# EAGLE schematic source_eagle (EAGLE 9.6.2)
COMPANY: ADAFRUIT INDUSTRIES; DRAWN: KTOWN; REV: B

## Sheet 1 of 2
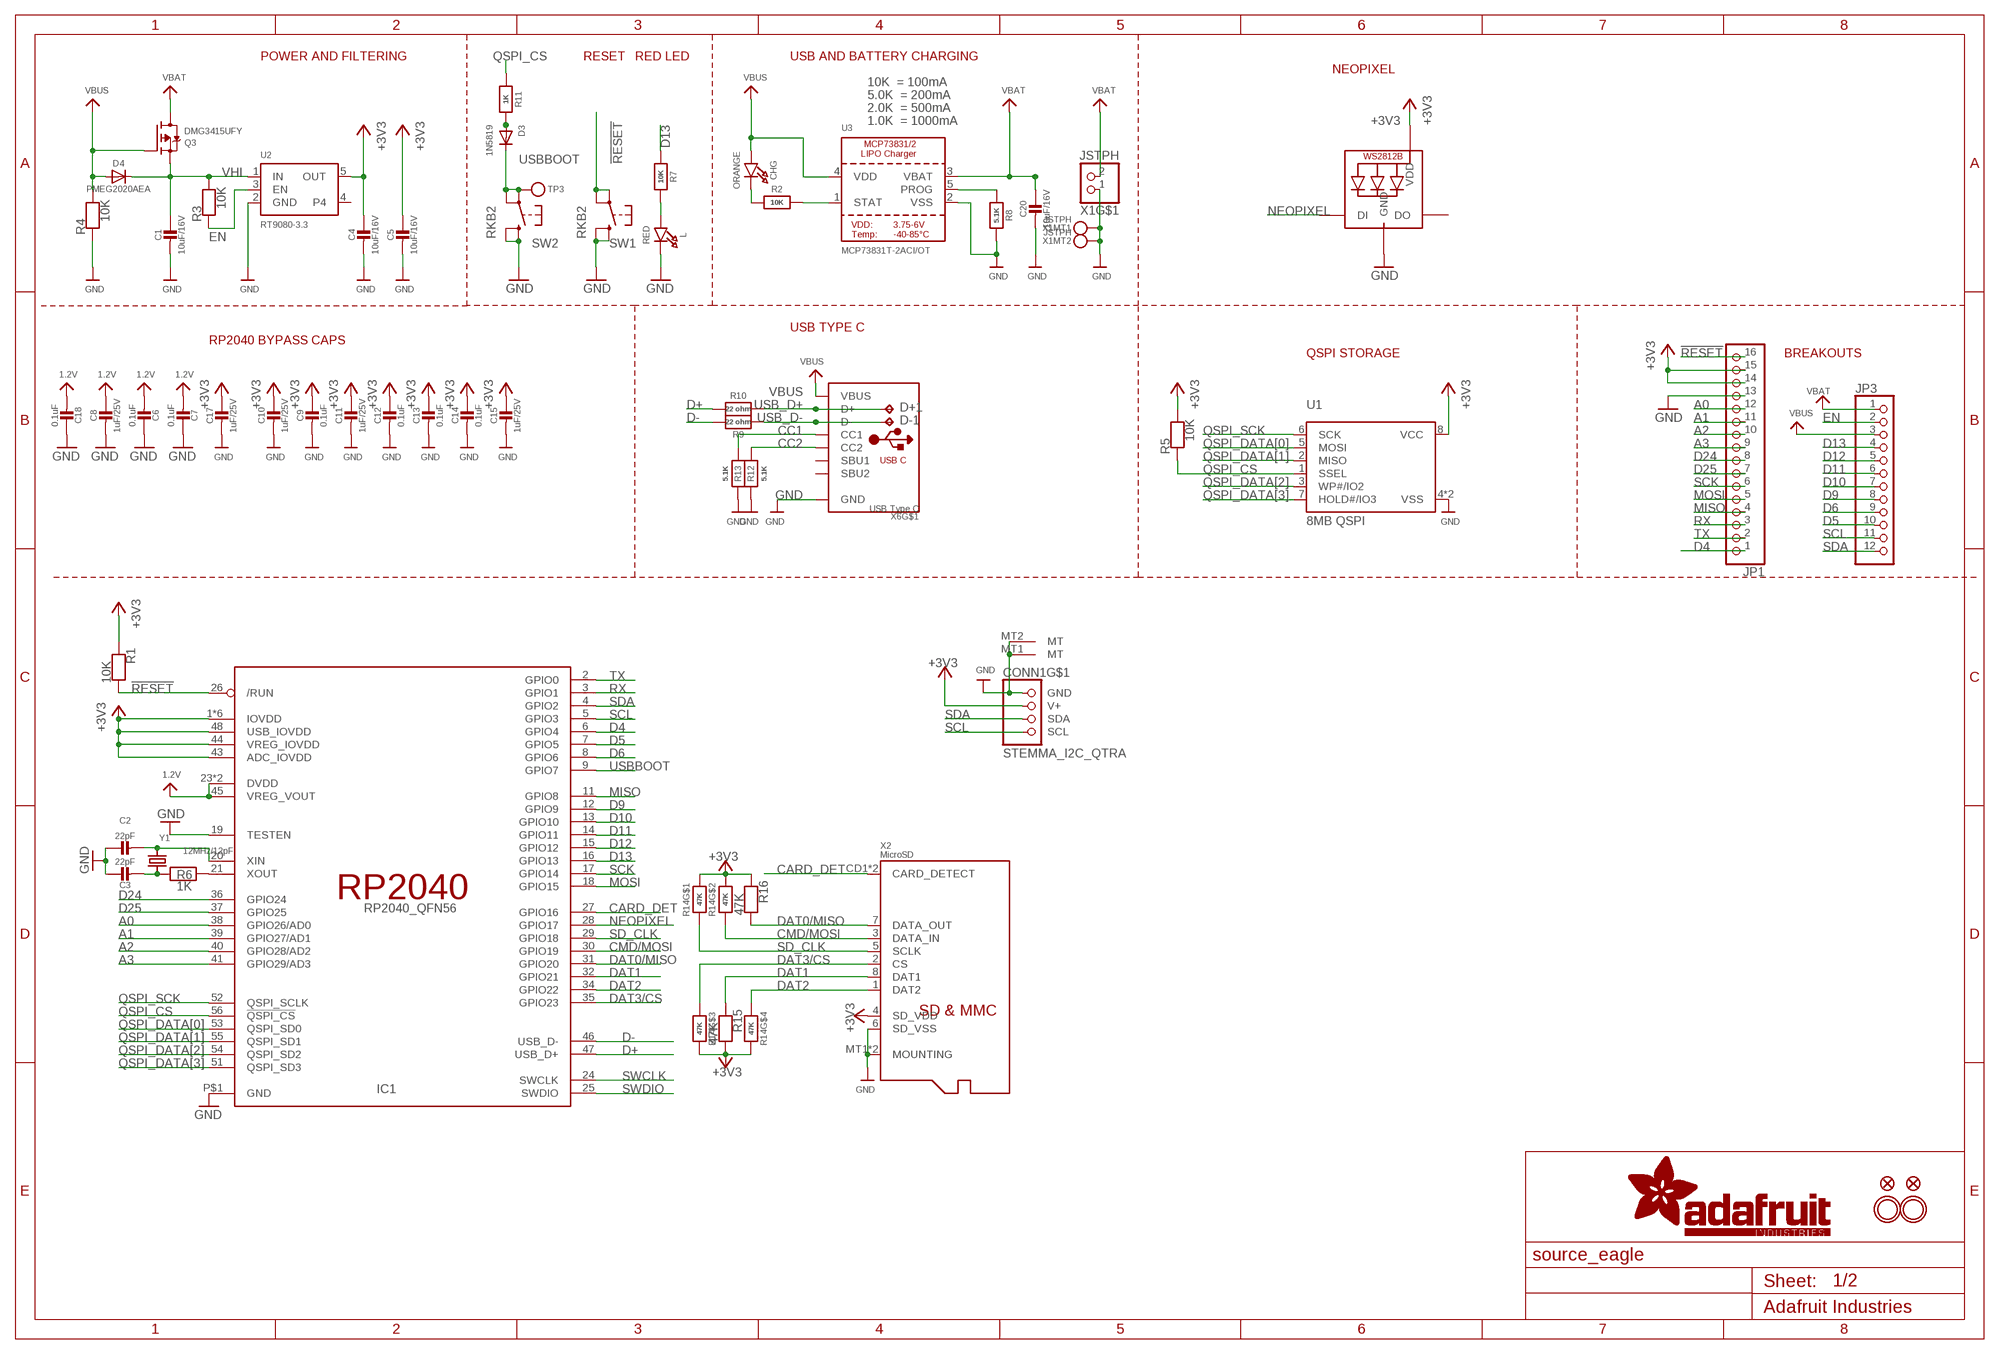
[diagram p0: schematic, sheet 1]

### Parts
C1  10uF/16V  CAP_CERAMIC0805-NOOUTLINE  [0805-NO]
C2  22pF  CAP_CERAMIC_0402NO  [_0402NO]
C3  22pF  CAP_CERAMIC_0402NO  [_0402NO]
C4  10uF/16V  CAP_CERAMIC0805-NOOUTLINE  [0805-NO]
C5  10uF/16V  CAP_CERAMIC0805-NOOUTLINE  [0805-NO]
C6  0.1uF  CAP_CERAMIC_0402NO  [_0402NO]
C7  0.1uF  CAP_CERAMIC_0402NO  [_0402NO]
C8  1uF/25V  CAP_CERAMIC_0402NO  [_0402NO]
C9  0.1uF  CAP_CERAMIC_0402NO  [_0402NO]
C10  1uF/25V  CAP_CERAMIC_0402NO  [_0402NO]
C11  1uF/25V  CAP_CERAMIC_0402NO  [_0402NO]
C12  0.1uF  CAP_CERAMIC_0402NO  [_0402NO]
C13  0.1uF  CAP_CERAMIC_0402NO  [_0402NO]
C14  0.1uF  CAP_CERAMIC_0402NO  [_0402NO]
C15  1uF/25V  CAP_CERAMIC_0402NO  [_0402NO]
C17  1uF/25V  CAP_CERAMIC_0402NO  [_0402NO]
C18  0.1uF  CAP_CERAMIC_0402NO  [_0402NO]
C20  10uF/16V  CAP_CERAMIC0805-NOOUTLINE  [0805-NO]
CHG  ORANGE  LED0603_NOOUTLINE  [CHIPLED_0603_NOOUTLINE]
CONN1  STEMMA_I2C_QTRA  [JST_SH4_RA]
D3  1N5819  DIODE_SOD323MINI  [SOD-323_MINI]
D4  PMEG2020AEA  DIODESOD-323F  [SOD-323F]
D+1  TPB1,27  [B1,27]
D-1  TPB1,27  [B1,27]
IC1  RP2040_QFN56  [QFN56_7MM_REDUCEDEPAD]
JP1  HEADER-1X16ROUND  [1X16_ROUND]
JP3  HEADER-1X12  [1X12_ROUND]
L  RED  LED0603_NOOUTLINE  [CHIPLED_0603_NOOUTLINE]
LED1  WS2812B_SK6805_1515  [SK6805_1515]
Q3  DMG3415UFY  MOSFET-P_DFN2015  [DFN2015-3]
R1  10K  RESISTOR_0402NO  [_0402NO]
R2  10K  RESISTOR_0402NO  [_0402NO]
R3  10K  RESISTOR_0402NO  [_0402NO]
R4  10K  RESISTOR_0402NO  [_0402NO]
R5  10K  RESISTOR_0402NO  [_0402NO]
R6  1K  RESISTOR_0402NO  [_0402NO]
R7  10K  RESISTOR_0402NO  [_0402NO]
R8  5.1K  RESISTOR_0402NO  [_0402NO]
R9  22 ohm  RESISTOR_0402NO  [_0402NO]
R10  22 ohm  RESISTOR_0402NO  [_0402NO]
R11  1K  RESISTOR_0402NO  [_0402NO]
R12  5.1K  RESISTOR_0402NO  [_0402NO]
R13  5.1K  RESISTOR_0402NO  [_0402NO]
R14  47K  RESISTOR_4PACK  [RESPACK_4X0603]
R15  47K  RESISTOR_0402NO  [_0402NO]
R16  47K  RESISTOR_0402NO  [_0402NO]
SW1  RKB2  SWITCH_TACT_SMT_RKB2  [BTN_RKB2_4.6X2.8]
SW2  RKB2  SWITCH_TACT_SMT_RKB2  [BTN_RKB2_4.6X2.8]
TP3  TESTPOINTROUND1.5MMNO  [TESTPOINT_ROUND_1.5MM_NO]
U1  8MB QSPI  SPIFLASH_8PIN_4X4  [USON8_4X4]
U2  RT9080-3.3  VREG_SOT23-5  [SOT23-5]
U3  MCP73831T-2ACI/OT  MCP73831/2  [SOT23-5]
U$31  MOUNTINGHOLE2.5  [MOUNTINGHOLE_2.5_PLATED]
U$32  MOUNTINGHOLE2.5  [MOUNTINGHOLE_2.5_PLATED]
U$34  FIDUCIAL_1MM  [FIDUCIAL_1MM]
U$35  FIDUCIAL_1MM  [FIDUCIAL_1MM]
X1  JSTPH  CON_JST_PH_2PIN_MT_BATT  [JSTPH2_BATT]
X2  MicroSD  MICROSD  [MICROSD]
X6  USB Type C  USB_C  [USB_C_CUSB31-CFM2AX-01-X]
Y1  12MHz/12pF  CRYSTAL2.5X2.0  [CRYSTAL_2.5X2]

### Nets
1.2V: C6.2 C7.2 C8.1 C18.2 IC1.23(DVDD) IC1.45(VREG_VOUT) IC1.50(DVDD)
!RESET: IC1.26(/RUN) JP1.16 R1.2 SW1.A'(P1) SW1.A(P)
+3V3: C4.1 C5.1 C9.1 C10.1 C11.1 C12.1 C13.1 C14.1 C15.1 C17.1 CONN1.2(V+) IC1.1(IOVDD) IC1.10(IOVDD) IC1.22(IOVDD) IC1.33(IOVDD) IC1.42(IOVDD) IC1.43(ADC_IOVDD) IC1.44(VREG_IOVDD) IC1.48(USB_IOVDD) IC1.49(IOVDD) JP1.14 JP1.15 LED1.2(VDD) R1.1 R5.2 R14.5 R14.6 R14.7 R14.8 R15.2 R16.1 U1.8(VCC) U2.5(OUT) X2.4(SD_VDD)
A0: IC1.38(GPIO26/AD0) JP1.12
A1: IC1.39(GPIO27/AD1) JP1.11
A2: IC1.40(GPIO28/AD2) JP1.10
A3: IC1.41(GPIO29/AD3) JP1.9
CARD_DET: IC1.27(GPIO16) X2.CD1(CARD_DETECT) X2.CD2(CARD_DETECT)
CC1: R13.2 X6.A5(CC1)
CC2: R12.2 X6.B5(CC2)
CMD/MOSI: IC1.30(GPIO19) R14.2 X2.3(DATA_IN)
D4: IC1.6(GPIO4) JP1.1
D5: IC1.7(GPIO5) JP3.10
D6: IC1.8(GPIO6) JP3.9
D9: IC1.12(GPIO9) JP3.8
D10: IC1.13(GPIO10) JP3.7
D11: IC1.14(GPIO11) JP3.6
D12: IC1.15(GPIO12) JP3.5
D13: IC1.16(GPIO13) JP3.4 R7.1
D24: IC1.36(GPIO24) JP1.8
D25: IC1.37(GPIO25) JP1.7
D+: IC1.47(USB_D+) R10.2
D-: IC1.46(USB_D-) R9.2
DAT0/MISO: IC1.31(GPIO20) R16.2 X2.7(DATA_OUT)
DAT1: IC1.32(GPIO21) R15.1 X2.8(DAT1)
DAT2: IC1.34(GPIO22) R14.4 X2.1(DAT2)
DAT3/CS: IC1.35(GPIO23) R14.3 X2.2(CS)
EN: JP3.2 R3.1 U2.3(EN)
GND [power]: C1.2 C2.1 C3.1 C4.2 C5.2 C6.1 C7.1 C8.2 C9.2 C10.2 C11.2 C12.2 C13.2 C14.2 C15.2 C17.2 C18.1 C20.2 CONN1.1(GND) CONN1.MT1(MT) CONN1.MT2(MT) IC1.19(TESTEN) IC1.P$1(GND) JP1.13 L.C LED1.4(GND) R4.1 R8.2 R12.1 R13.1 SW1.B'(S1) SW1.B(S) SW2.B'(S1) SW2.B(S) U1.4(VSS) U1.PAD(VSS) U2.2(GND) U3.2(VSS) X1.1 X1.NC1 X1.NC2 X2.6(SD_VSS) X2.MT1(MOUNTING) X2.MT2(MOUNTING) X6.A1B12(GND) X6.B1A12(GND)
MISO: IC1.11(GPIO8) JP1.4
MOSI: IC1.18(GPIO15) JP1.5
N$1: CHG.C R2.1
N$2: L.A R7.2
N$3: R2.2 U3.1(STAT)
N$4: R8.1 U3.5(PROG)
N$5: C2.2 IC1.20(XIN) Y1.3
N$6: C3.2 R6.1 Y1.1
N$7: IC1.21(XOUT) R6.2
N$16: D3.A R11.2
NEOPIXEL: IC1.28(GPIO17) LED1.1(DI)
QSPI_CS: IC1.56(!QSPI_CS) R5.1 R11.1 U1.1(SSEL)
QSPI_DATA[0]: IC1.53(QSPI_SD0) U1.5(MOSI)
QSPI_DATA[1]: IC1.55(QSPI_SD1) U1.2(MISO)
QSPI_DATA[2]: IC1.54(QSPI_SD2) U1.3(WP#/IO2)
QSPI_DATA[3]: IC1.51(QSPI_SD3) U1.7(HOLD#/IO3)
QSPI_SCK: IC1.52(QSPI_SCLK) U1.6(SCK)
RX: IC1.3(GPIO1) JP1.3
SCK: IC1.17(GPIO14) JP1.6
SCL: CONN1.4(SCL) IC1.5(GPIO3) JP3.11
SD_CLK: IC1.29(GPIO18) R14.1 X2.5(SCLK)
SDA: CONN1.3(SDA) IC1.4(GPIO2) JP3.12
SWCLK: IC1.24(SWCLK)
SWDIO: IC1.25(SWDIO)
TX: IC1.2(GPIO0) JP1.2
USB_D+: D+1.TP R10.1 X6.A6(D+) X6.B6(D+)
USB_D-: D-1.TP R9.1 X6.A7(D-) X6.B7(D-)
USBBOOT: D3.C IC1.9(GPIO7) SW2.A'(P1) SW2.A(P) TP3.P$1
VBAT [power]: C20.1 JP3.1 Q3.3(D) U3.3(VBAT) X1.2
VBUS [power]: CHG.A D4.A JP3.3 Q3.1(G) R4.2 U3.4(VDD) X6.A4B9(VBUS) X6.B4A9(VBUS)
VHI: C1.1 D4.C Q3.2(S) R3.2 U2.1(IN)
Unconnected: LED1.3(DO) U2.4 X6.A8(SBU1) X6.B8(SBU2) X6.M1(MT) X6.M2(MT) X6.M3(MT) X6.M4(MT)

### Notes on the sheet
- POWER AND FILTERING | RESET | RED LED | USB AND BATTERY CHARGING
- NEOPIXEL
- 10K  = 100mA
- 5.0K  = 200mA
- 2.0K  = 500mA
- 1.0K  = 1000mA
- USB TYPE C
- RP2040 BYPASS CAPS
- QSPI STORAGE | BREAKOUTS

## Sheet 2 of 2

## Library data of the parts
C1-C3 C5-C15 C17 C18 C20 = microbuilder:CAP_CERAMIC: Ceramic Capacitors For new designs, use the packages preceded by an '_' character since they are more reliable: The following footprints should be used on most boards: _0402 - Standard footprint for regular board layouts _0603 - Standard footprint for regular board layouts _0805 - Standard footprint for regular board layouts _1206 - Standard footprint for regular board layouts For extremely tight-pitch boards where space is at a premium, the following 'micro-pitch' footprints can be used (smaller pads, no silkscreen outline, etc.): _0402MP - Micro-pitch footprint for very dense/compact boards _0603MP - Micro-pitch footprint for very dense/compact boards _0805MP - Micro-pitch footprint for very dense/compact boards _1206MP - Micro-pitch footprint for very dense/compact boards
C4 = microbuilder:CAP_CERAMIC: Ceramic Capacitors For new designs, use the packages preceded by an '_' character since they are more reliable: The following footprints should be used on most boards: _0402 - Standard footprint for regular board layouts _0603 - Standard footprint for regular board layouts _0805 - Standard footprint for regular board layouts _1206 - Standard footprint for regular board layouts For extremely tight-pitch boards where space is at a premium, the following 'micro-pitch' footprints can be used (smaller pads, no silkscreen outline, etc.): _0402MP - Micro-pitch footprint for very dense/compact boards _0603MP - Micro-pitch footprint for very dense/compact boards _0805MP - Micro-pitch footprint for very dense/compact boards _1206MP - Micro-pitch footprint for very dense/compact boards; REV: A
CHG L = microbuilder:LED: LED 0603 - 0603 Surface Mount Package 2mA: Green LED - Low Power (3.9mcd, 2ma, 1.7Vf) - Digikey: 475-2709-2-ND Orange LED - Low Power (9.8mcd, 2ma, 1.8Vf) - Digikey: 475-1194-2-ND Red LED - Low Power (5mcd, 2ma, 1.8Vf) - Digikey: 475-1195-2-ND Yellow LED - Low Power (7mcd, 2ma, 1.8Vf) - Digikey: 475-1196-2-ND 5mA: Blue LED - Low Power (17mcd, 5ma, 2.9Vf) - Digikey: LNJ937W8CRACT-ND 0805 - 0805 Surface Mount Package 2mA: Red LED (8.8mcd, 2mA, 1.8Vf, Clear) - Low Power [Digikey: 475-2510-1-ND] Green LED (5mcd, 2mA, 1.8Vf, Clear) - Low Power [Digikey: 475-2730-1-ND] Yellow LED (11.3mcd, 2mA, 1.8Vf, Clear) - Low Power [Digikey: 475-2555-1-ND] 20mA: Red LED (104mcd, 20mA, Diffused) - LS R976 [Digikey: 475-1278-6-ND] Red LED (12mcd, 20mA, 2.0Vf, Clear) - APT2012EC [Digikey: 754-1128-1-ND] Green LED (15mcd, 20mA, 2.2Vf, Clear) - APT2012GC [Digikey: 754-1131-1-ND] Orange LED (160mcd, 20mA, 2.1Vf, Clear) - APT2012SECK [Digikey: 754-1130-1-ND] 1206 - 1206 Surface Mount Package Green LED (26mcd, 20mA, Diffused) - LG N971 [Digikey: 475-1407-6-ND] Red LED (15mcd, 20mA, Diffused) - LH N974 [Digikey: 475-1416-6-ND] Cree - Cree High-Power Surface Mount LEDs XPEBWT-L1-0000-00D50 - White 111lm 350mA 2.9Vf 6200K 110° XTEAWT-00-0000-00000LEE3 - White 114lm 350mA 2.85Vf 5000K 115° Everlight - Everlight 45-21 Series Surface Mount LEDs 45-21/QK2C-B2832AC2CB2/2T - Warm White 2000mcd 20mA 3.25Vf 3050K 120° 45-21/LK2C-B38452C4CB2/2T - Nuetral White 2000mcd 20mA 3.25Vf 4150K 120° 45-21/LK2C-B50634C6CB2/2T - Cold White 2200mcd 20mA 3.25Vf 5650K 120° PLCC2 Reverse Mount LS T77K-J1L2-1-0-2-R18-Z - Red 11.25mcd 2mA 1.8Vf 630nm 120° LO T77K-L1M2-24-Z - Orange 19.6mcd 2mA 1.8Vf 606nm 120° LY T77K-K2M1-26-Z - Yellow 15.7mcd 2mA 1.8Vf 587nm 120°; ROT: 270
CONN1 = adafruit_electromech:STEMMA_I2C; LCSC: C145961
D3 = microbuilder:DIODE: Diode
D4 = adafruit:DIODE: Diode
D+1 D-1 = testpad:TP: Test pad
IC1 = adafruit_micro:RP2040; LCSC: C2040
JP1 = microbuilder:HEADER-1X16: PIN HEADER
JP3 = microbuilder:HEADER-1X12
LED1 = microbuilder:WS2812B; LCSC: C2890035
Q3 = microbuilder:MOSFET-P: P-Channel Mosfet LEGEND VDS: Voltage Drain-Source ID: Drain Current RDS(ON): Drain-Source On-State Resistance VGS(TH): Gate-Source Threshold Voltage CISS: Drain-Source Input Capacitance SOT-23 Name VDS ID RDS(ON) VGS(TH) CISS Order Number IRLML5103 30V 760mA 600 mOhm -- 75pF @ 25V Digikey: IRLML5103PBFCT-ND IRLML6401 12V 4.3A 50 mOhm 950mV @ 250µA 830pF @ 10V Digikey: IRLML6401PBFTR-ND NTR0202PL 20V 400mA 800 mOhm 2.3V @ 250uA 70pF @ 5V Digikey: NTR0202PLT1GOSTR-ND NTR4101PT1G 20V 1.8A 85 mOhm 1.2V @ 250uA 675pF @ 10V Digikey: NTR4101PT1GOSCT-ND DMP2004K 20V 600mA 900 mOhm 1V @ 250uA 175pF @ 16V Digikey: DMP2004KDICT-ND PMV65XP 20V 3.9A 76 mOhm 950mV @ 1mA 725pF @ 20V Digikey: 568-2358-2-ND TO-252 Name VDS ID RDS(ON) VGS(TH) CISS Order Number AOD417 30V 25A 34 mOhm 3V @ 250µA 920pF @ 15V Digikey: 785-1106-2-ND PowerPak Name VDS ID RDS(ON) VGS(TH) CISS Order Number AON7401 30V 12A 14 mOhm 3V @ 250µA 2600pF @ 15V Digikey: 785-1302-1-ND
R1-R13 R15 R16 = microbuilder:RESISTOR: Resistors For new designs, use the packages preceded by an '_' character since they are more reliable: The following footprints should be used on most boards: _0402 - Standard footprint for regular board layouts _0603 - Standard footprint for regular board layouts _0805 - Standard footprint for regular board layouts _1206 - Standard footprint for regular board layouts For extremely tight-pitch boards where space is at a premium, the following 'micro-pitch' footprints can be used (smaller pads, no silkscreen outline, etc.): _0402MP - Micro-pitch footprint for very dense/compact boards _0603MP - Micro-pitch footprint for very dense/compact boards _0805MP - Micro-pitch footprint for very dense/compact boards _1206MP - Micro-pitch footprint for very dense/compact boards
R14 = microbuilder:RESISTOR_4PACK: Resistor Packs (4 resistors) 4 x 0603 10K 1/16W - Digikey: YC164J-10KCT-ND
SW1 SW2 = adafruit_electromech:SWITCH_TACT_SMT: SMT Tact Switches RKB2 https://www.digikey.com/short/m027prz5
TP3 = microbuilder:TESTPOINT: Test Point Various test points for characterisation and PCB testing TESTPOINT_SMT - Compact Surface Mount Test Point [Digikey: 5016KTR-ND]
U1 = microbuilder:SPIFLASH_8PIN: SOIC8 SPI Flash Be careful with the size since SOIC8 flash comes in several 'widths' SOIC8 150 mil M25P16 - 16Mbit (2Mbit x 8) Serial Flash (75MHz SPI Bus), Supply: 2.7-3.6V Digikey: SOIC8 - M25P16-VMN6P-ND SOIC8 208 mil W25Q16BVSSIG - 16Mbit (2Mbit x 8) Serial Flash (104MHz SPI Bus), Supply: 2.7-3.6V Digikey: SOIC8 - W25Q16BVSSIG-ND
U2 = adafruit_power:VREG_SOT23-5: SOT23-5 Fixed Voltage Regulators Part Current Out V Out V In V Dropout θJA (°C/W) TJ (°C) Digikey Part No. ADP121 150mA 3.3V 3.4-5.5V 0.09V @ 150mA -- -- ADP121-AUJZ33R7CT-ND ADP121 150mA 3.0V 3.1-5.5V 0.09V @ 150mA -- -- ADP121-AUJZ30R7CT-ND ADP122 300mA 3.3V 3.4-5.5V 0.085V @ 300mA -- -- ADP122AUJZ-3.3-R7CT-ND ADP1712 300mA 3.3V 3.5-5.5V 0.17V @ 300mA -- -- ADP1712AUJZ-3.3-R7TR-ND AP7311 (Low Cost) 150mA 3.3V 3.5-6V 0.15V @ 150mA -- -- AP7311-33WG-7DICT-ND LD39015M18R 150mA 1.8V 1.9V-5.5V 0.08V @ 100mA -- -- 497-6977-1-ND LP2985A-33DBVR 150mA 3.3V 3.3-16V 0.28V @ 150mA 206 150 296-18479-1-ND MCP1824T-3302E/OT 300mA 3.3V 3.5V-6V 0.2V @ 300mA -- -- MCP1824T-3302E/OTCT-ND MIC5205-2.5YM5 TR 150mA 2.5V 2.7-16V 0.165V @ 150mA -- -- 576-1257-2-ND MIC5205-3.0YM5 TR 150mA 3.0V 3.2V-16V 0.165V @ 150mA -- -- 576-1258-2-ND MIC5205-3.3YM5 TR 150mA 3.3V 3.5V-16V 0.165V @ 150mA -- -- 576-1259-2-ND TPS780330220 150mA 3.3V+2.2V 3.6-5.5V 250mV Max -- -- 296-23332-1-ND TDA3663/N1,135 100mA 3.3V 3.5-45V 0.18V @ 50mA -- -- 568-5343-1-ND Max operating temp can be calculated using θJA, TJ (max junction temperature), and power in watts. Set the "Maximum Ambient Temperature" until it reaches TJ ("Max Junction Temperature"), which is the absolute limit for safe use of the regulator: Heat Sink Temperature Calculator <http://www.daycounter.com/Calculators/Heat-Sink-Temperature-Calculator.phtml> For example, With 12V source into a 3.3V LP2985 and a 30mA load, we are dissipating (12V-3.3V) * 0.03A = 0.261W. With a θJA of 206 °C/W, a TJ of 150°C, and 261mW we can safely use the chip without a heat sink up to 75°C (=147.1°C Junction Temperature).; JLC_ROTATION: 0
U3 = microbuilder:MCP73831/2: MCP73831/2 LIPO Charger VDD: 3.75 - 6V Temp -40 - 85°C Programmable Charge Rate: 15-500mA NOTE: STAT is a tri-state logic output on the MCP73831 and an open-drain output on the MCP73832. SOT23-5 with 4.2V output and tri-state logic on STAT = MCP73831T-2ACI/OT; JLC_ROTATION: 0; LCSC: C424093
U$31 U$32 = adafruit_electromech:MOUNTINGHOLE: Mounting Hole For #2 screws (0.086"/2.18mm width, 0.094"/2.4mm hole) use 2.5mm; BOM: EXCLUDE
U$34 U$35 = microbuilder:FIDUCIAL: Fiducial Alignment Points Various fiducial points for machine vision alignment.; BOM: EXCLUDE
X1 = adafruit_electromech:CON_JST_PH_2PIN_MT; LCSC: C47647
X2 = adafruit_electromech:MICROSD: MicroSD/Transflash Card Holder with SPI pinout 3M: 2908-05WB-MG 4UConnector: 19656 Footprint courtesy: Adafruit Industries; JLC_ROTATION: 90; LCSC: C125617
X6 = adafruit_electromech:USB_C: USB Type-C USB 2.0 Connector; LCSC: C165948
Y1 = microbuilder:CRYSTAL: Crystals HC49UP - Surface Mount Crystal 4.0MHz 18pF +/-30ppm Surface Mount Crystal [Digikey: 535-9857-1-ND] 12.0 MHz Surface Mount Crystal [Digikey: 535-9869-6-ND] 25.0 MHz Surface Mount Crystal [Digikey: 535-9078-1-ND] 2.5 x 2.0mm - MEMs SMT Crystal 16.0 MHz 10pF 20ppm 2.5 x 2.0mm Crystal [Digikey -40-85°C: 535-10923-1-ND] 3.2 x 2.5mm - MEMs SMT Crystal 12.0 MHz 8pF 15ppm 3.2 x 2.5mm Crystal [Digikey: -10-70°C: 644-1047-1-ND -40-125°C: 644-1128-1-ND] 40~85°C cheaper: 644-1173-6-ND 16.0 MHz 8pF 15ppm 3.2 x 2.5mm Crystal [Digikey: -10-70°C: 644-1049-1-ND -40-125°C: 644-1129-2-ND]-40~85°C cheaper: 644-1175-6-ND 16.0 MHz 10pF 10ppm 3.2 x 2.5mm Crystal [Digikey: 644-1100-1-ND] 27.12 MHz 18pF 30ppm 3.2 x 2.5mm Crystal [Digikey: 887-1424-1-ND] 27.12MHz 10pF 10ppm 3.2 x 2.5mm Crystal [Digikey: 887-1329-1-ND] 4.9 x 1.8mm - MEMs SMT Crystal 32.768 KHz 12.5pF 20ppm 4.9 x 1.8mm Crystal [Digikey: SE2415CT-ND] 8.0 x 3.8mm - Surface Mount Crystal 32.768kHz 12.5pF 20ppm -40°C-85°C [Digikey: 535-9166-2-ND] Cylinder 32.768KHz Cylinder Crystal (2x6mm body) [Ex. Digikey: 300-8341-2-ND]

## Net classes
1 power: width 0.305 mm
2 lowpower: width 0.254 mm, drill 0.381 mm